# EasyEDA schematic audio chip.json
TITLE: Sheet_1; REV: 1.0; Date: 2023-10-21; Sheet: 1/1; Company: Your Company
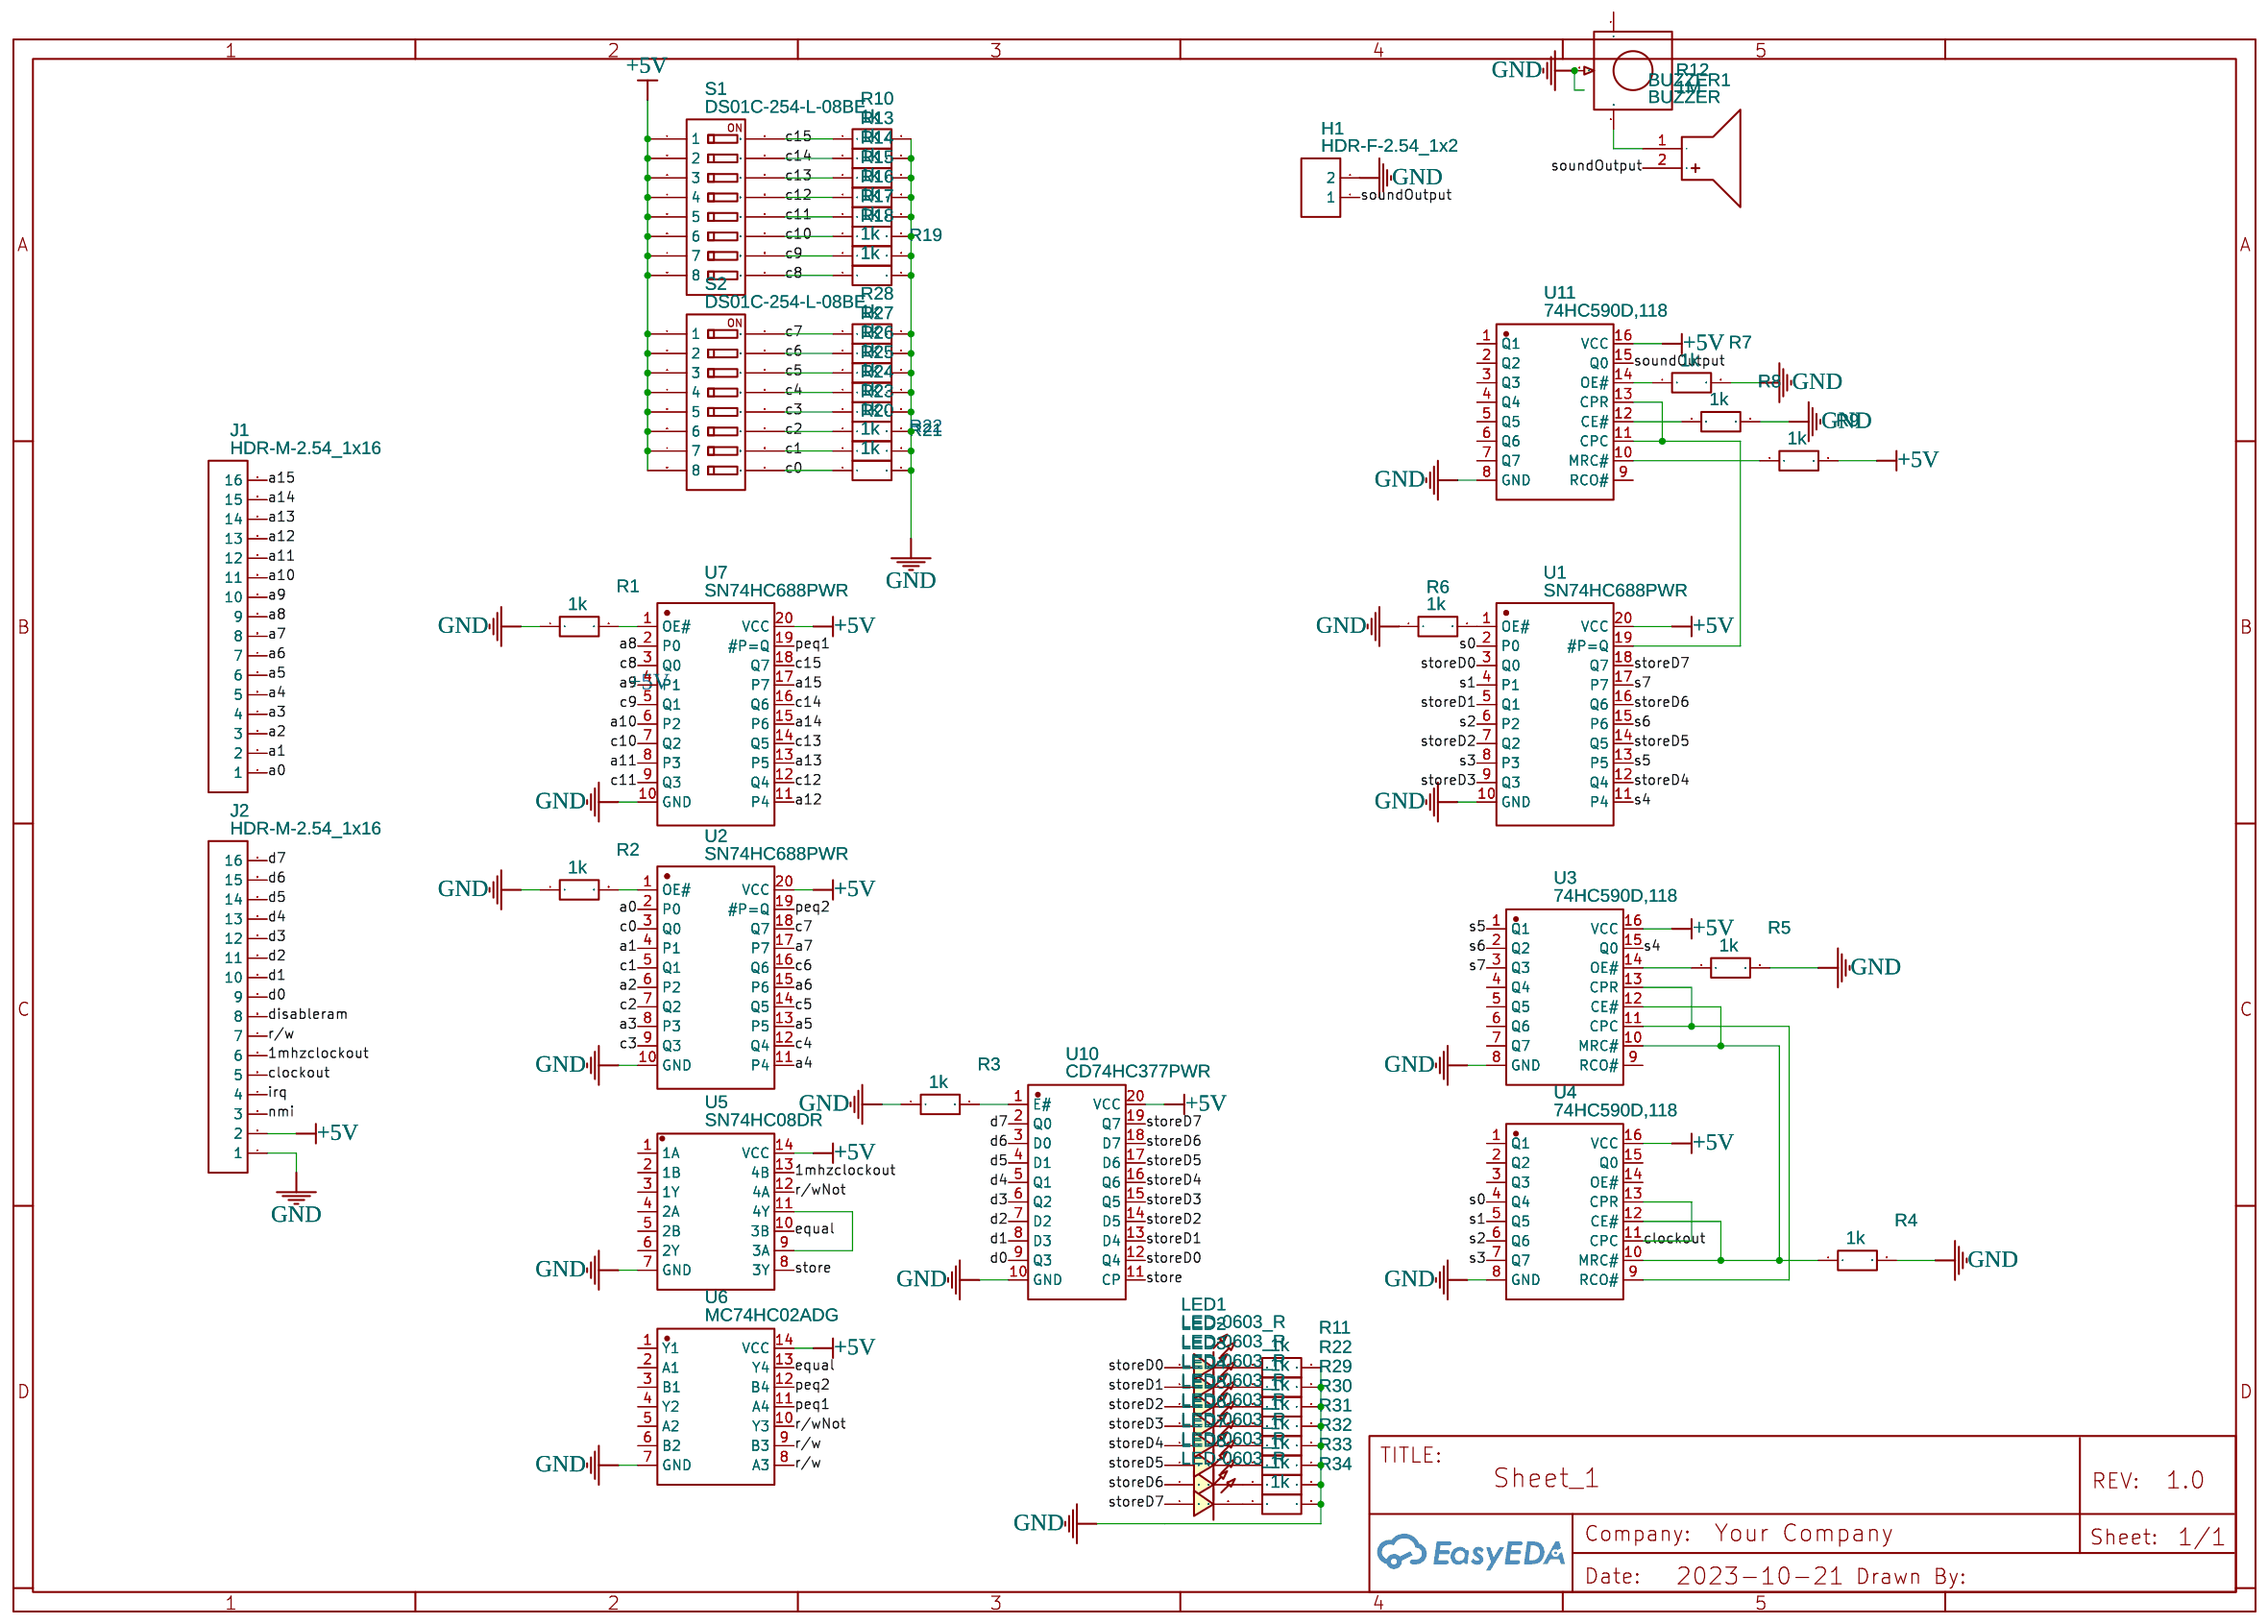
[diagram p0: schematic sheet]

## Parts
BUZZER1  BUZZER  [BUZ-TH_BD12.0-P6.00-D0.9-RD]
H1  HDR-F-2.54_1x2  [HDR-F-2.54_1X2]
J1  HDR-M-2.54_1x16  [HDR-M-2.54_1X16]
J2  HDR-M-2.54_1x16  [HDR-M-2.54_1X16]
LED1  LED-0603_R  [LED0603_RED]
LED2  LED-0603_R  [LED0603_RED]
LED3  LED-0603_R  [LED0603_RED]
LED4  LED-0603_R  [LED0603_RED]
LED5  LED-0603_R  [LED0603_RED]
LED6  LED-0603_R  [LED0603_RED]
LED7  LED-0603_R  [LED0603_RED]
LED8  LED-0603_R  [LED0603_RED]
R1  1k  [R1206]
R2  1k  [R1206]
R3  1k  [R1206]
R4  1k  [R1206]
R5  1k  [R1206]
R6  1k  [R1206]
R7  1k  [R1206]
R8  1k  [R1206]
R9  1k  [R1206]
R10  1k  [R1206]
R11  1k  [R1206]
R12  1M  [3386T]
R13  1k  [R1206]
R14  1k  [R1206]
R15  1k  [R1206]
R16  1k  [R1206]
R17  1k  [R1206]
R18  1k  [R1206]
R19  1k  [R1206]
R20  1k  [R1206]
R21  1k  [R1206]
R22  1k  [R1206]
R23  1k  [R1206]
R24  1k  [R1206]
R25  1k  [R1206]
R26  1k  [R1206]
R27  1k  [R1206]
R28  1k  [R1206]
R29  1k  [R1206]
R30  1k  [R1206]
R31  1k  [R1206]
R32  1k  [R1206]
R33  1k  [R1206]
R34  1k  [R1206]
S1  DS01C-254-L-08BE  [DS01C-254-L-08BE]
S2  DS01C-254-L-08BE  [DS01C-254-L-08BE]
U1  SN74HC688PWR  [TSSOP-20_L6.5-W4.4-P0.65-LS6.4-BL]
U2  SN74HC688PWR  [TSSOP-20_L6.5-W4.4-P0.65-LS6.4-BL]
U3  74HC590D,118  [SO-16_L9.9-W3.9-P1.27-LS6.0-BL]
U4  74HC590D,118  [SO-16_L9.9-W3.9-P1.27-LS6.0-BL]
U5  SN74HC08DR  [SOIC-14_L8.7-W3.9-P1.27-LS6.0-BL]
U6  MC74HC02ADG  [SOIC-14_L8.7-W3.9-P1.27-LS6.0-BL]
U7  SN74HC688PWR  [TSSOP-20_L6.5-W4.4-P0.65-LS6.4-BL]
U10  CD74HC377PWR  [TSSOP-20_L6.5-W4.4-P0.65-LS6.4-BL]
U11  74HC590D,118  [SO-16_L9.9-W3.9-P1.27-LS6.0-BL]

## Library data of the parts
BUZZER1 = BUZZER: Contributor: lcsc; Supplier: LCSC; Supplier Part: C9900014030; Manufacturer: null; Manufacturer Part: buzzer; JLCPCB Part Class: Extended Part; link: https://lcsc.com/eda_search?q=C9900014030&%26type=1&ref=editor
H1 = HDR-F-2.54_1x2: Supplier Part: C49661; Supplier: LCSC; Contributor: LCEDA_Lib
J1 J2 = HDR-M-2.54_1x16: Supplier: LCSC; Contributor: LCEDA_Lib
LED1-LED8 = LED-0603_R: Manufacturer: EVERLIGHT(台湾亿光); Manufacturer Part: 19-217/R6C-AL1M2VY/3T; Supplier Part: C72044; Supplier: LCSC; Contributor: LCEDA_01
R1-R11 R13-R34 = R_1206_EU: Contributor: LCEDA_Lib
R12 = 3/8 Inch Square Cermet Potentiometer 1MEG Ohms 1/2 Watt 1 Turn Thru Hole: Manufacturer: Jameco ValuePro; Manufacturer Part: 3386T-1-LS1MEG(105); Supplier Part: 2161422; link: https://www.jameco.com/webapp/wcs/stores/servlet/ProductDisplay?storeId=10001&langId=-1&catalogId=10001&productId=2161422; Contributor: dissy614
S1 S2 = DS01C-254-L-08BE: Manufacturer: CUI Devices; Manufacturer Part: DS01C-254-L-07BE; Supplier: Mouser; Supplier Part: 490-DS01C-254-L-07BE; link: https://www.mouser.com/datasheet/2/670/ds01-254-1777712.pdf; Contributor: CK Sim
U1 U2 U7 = SN74HC688PWR: Contributor: LCSC; Supplier: LCSC; Manufacturer: TI(德州仪器); Supplier Part: C132045; JLCPCB Part Class: Extended Part; link: https://lcsc.com/eda_search?q=C132045&%26type=1&ref=editor
U3 U4 U11 = 74HC590D,118: Contributor: LCSC; Supplier: LCSC; Supplier Part: C547118; Manufacturer: Nexperia(安世); JLCPCB Part Class: Extended Part; link: https://lcsc.com/eda_search?q=C547118&%26type=1&ref=editor
U5 = SN74HC08DR: Contributor: LCSC; Supplier: LCSC; Supplier Part: C337768; Manufacturer: TI(德州仪器); JLCPCB Part Class: Extended Part; link: https://lcsc.com/eda_search?q=C337768&%26type=1&ref=editor
U6 = MC74HC02ADG: Contributor: LCSC; Supplier: LCSC; Supplier Part: C233598; Manufacturer: onsemi(安森美); JLCPCB Part Class: Extended Part; link: https://lcsc.com/eda_search?q=C233598&%26type=1&ref=editor
U10 = CD74HC377PWR: Contributor: LCSC; Supplier: LCSC; Supplier Part: C2677832; Manufacturer: TI(德州仪器); JLCPCB Part Class: Extended Part; link: https://lcsc.com/eda_search?q=C2677832&%26type=1&ref=editor

## Nets
+5V: J2.2 R9.2 S1.1 S1.2 S1.3 S1.4 S1.5 S1.6 S1.7 S1.8 S2.1 S2.2 S2.3 S2.4 S2.5 S2.6 S2.7 S2.8 U1.20(VCC) U2.20(VCC) U3.16(VCC) U4.16(VCC) U5.14(VCC) U6.14(VCC) U7.20(VCC) U10.20(VCC) U11.16(VCC)
GND: H1.2 J2.1 R1.1 R2.1 R3.1 R4.2 R5.2 R6.1 R7.2 R8.2 R10.2 R11.2 R12.2 R13.2 R14.2 R15.2 R16.2 R17.2 R18.2 R19.2 R20.2 R21.2 R22.2 R23.2 R24.2 R25.2 R26.2 R27.2 R28.2 R29.2 R30.2 R31.2 R32.2 R33.2 R34.2 U1.10(GND) U2.10(GND) U3.8(GND) U4.8(GND) U5.7(GND) U6.7(GND) U7.10(GND) U10.10(GND) U11.8(GND)
1mhzclockout: J2.6 U5.13(4B)
a0: J1.1 U2.2(P0)
a1: J1.2 U2.4(P1)
a2: J1.3 U2.6(P2)
a3: J1.4 U2.8(P3)
a4: J1.5 U2.11(P4)
a5: J1.6 U2.13(P5)
a6: J1.7 U2.15(P6)
a7: J1.8 U2.17(P7)
a8: J1.9 U7.2(P0)
a9: J1.10 U7.4(P1)
a10: J1.11 U7.6(P2)
a11: J1.12 U7.8(P3)
a12: J1.13 U7.11(P4)
a13: J1.14 U7.13(P5)
a14: J1.15 U7.15(P6)
a15: J1.16 U7.17(P7)
c0: R21.1 S2.9 U2.3(Q0)
c1: R20.1 S2.10 U2.5(Q1)
c2: R23.1 S2.11 U2.7(Q2)
c3: R24.1 S2.12 U2.9(Q3)
c4: R25.1 S2.13 U2.12(Q4)
c5: R26.1 S2.14 U2.14(Q5)
c6: R27.1 S2.15 U2.16(Q6)
c7: R28.1 S2.16 U2.18(Q7)
c8: R19.1 S1.9 U7.3(Q0)
c9: R18.1 S1.10 U7.5(Q1)
c10: R17.1 S1.11 U7.7(Q2)
c11: R16.1 S1.12 U7.9(Q3)
c12: R15.1 S1.13 U7.12(Q4)
c13: R14.1 S1.14 U7.14(Q5)
c14: R13.1 S1.15 U7.16(Q6)
c15: R10.1 S1.16 U7.18(Q7)
clockout: J2.5 U4.11(CPC) U4.13(CPR)
d0: J2.9 U10.9(Q3)
d1: J2.10 U10.8(D3)
d2: J2.11 U10.7(D2)
d3: J2.12 U10.6(Q2)
d4: J2.13 U10.5(Q1)
d5: J2.14 U10.4(D1)
d6: J2.15 U10.3(D0)
d7: J2.16 U10.2(Q0)
disableram: J2.8
equal: U5.10(3B) U6.13(Y4)
irq: J2.4
nmi: J2.3
peq1: U6.11(A4) U7.19(#P=Q)
peq2: U2.19(#P=Q) U6.12(B4)
r/w: J2.7 U6.8(A3) U6.9(B3)
r/wNot: U5.12(4A) U6.10(Y3)
s0: U1.2(P0) U4.4(Q4)
s1: U1.4(P1) U4.5(Q5)
s2: U1.6(P2) U4.6(Q6)
s3: U1.8(P3) U4.7(Q7)
s4: U1.11(P4) U3.15(Q0)
s5: U1.13(P5) U3.1(Q1)
s6: U1.15(P6) U3.2(Q2)
s7: U1.17(P7) U3.3(Q3)
soundOutput: BUZZER1.2(+) H1.1 U11.15(Q0)
store: U5.8(3Y) U10.11(CP)
storeD0: LED1.1 U1.3(Q0) U10.12(Q4)
storeD1: LED2.1 U1.5(Q1) U10.13(D4)
storeD2: LED3.1 U1.7(Q2) U10.14(D5)
storeD3: LED4.1 U1.9(Q3) U10.15(Q5)
storeD4: LED5.1 U1.12(Q4) U10.16(Q6)
storeD5: LED6.1 U1.14(Q5) U10.17(D6)
storeD6: LED7.1 U1.16(Q6) U10.18(D7)
storeD7: LED8.1 U1.18(Q7) U10.19(Q7)
Net-(BUZZER1-1): BUZZER1.1(-) R12.3
Net-(LED1-2): LED1.2 R11.1
Net-(LED2-2): LED2.2 R22.1
Net-(LED3-2): LED3.2 R29.1
Net-(LED4-2): LED4.2 R30.1
Net-(LED5-2): LED5.2 R31.1
Net-(LED6-2): LED6.2 R32.1
Net-(LED7-2): LED7.2 R33.1
Net-(LED8-2): LED8.2 R34.1
Net-(R1-2): R1.2 U7.1(OE#)
Net-(R2-2): R2.2 U2.1(OE#)
Net-(R3-2): R3.2 U10.1(E#)
Net-(R4-1): R4.1 U3.10(MRC#) U3.12(CE#) U4.10(MRC#) U4.12(CE#)
Net-(R5-1): R5.1 U3.14(OE#)
Net-(R6-2): R6.2 U1.1(OE#)
Net-(R7-1): R7.1 U11.14(OE#)
Net-(R8-1): R8.1 U11.12(CE#)
Net-(R9-1): R9.1 U11.10(MRC#)
Net-(U1-19): U1.19(#P=Q) U11.11(CPC) U11.13(CPR)
Net-(U3-11): U3.11(CPC) U3.13(CPR) U4.9(RCO#)
Net-(U5-9): U5.9(3A) U5.11(4Y)

Not connected (* = marked no-connect by the designer): R12 1; U3 4(Q4) 5(Q5) 6(Q6) 7(Q7) 9(RCO#); U4 1(Q1) 2(Q2) 3(Q3) 14(OE#) 15(Q0); U5 1(1A) 2(1B) 3(1Y) 4(2A) 5(2B) 6(2Y); U6 1(Y1) 2(A1) 3(B1) 4(Y2) 5(A2) 6(B2); U11 1(Q1) 2(Q2) 3(Q3) 4(Q4) 5(Q5) 6(Q6) 7(Q7) 9(RCO#)

## Notes on the sheet
- R22
- +5V
